# EAGLE design Cap Drop LDR (EAGLE 8.5.1)
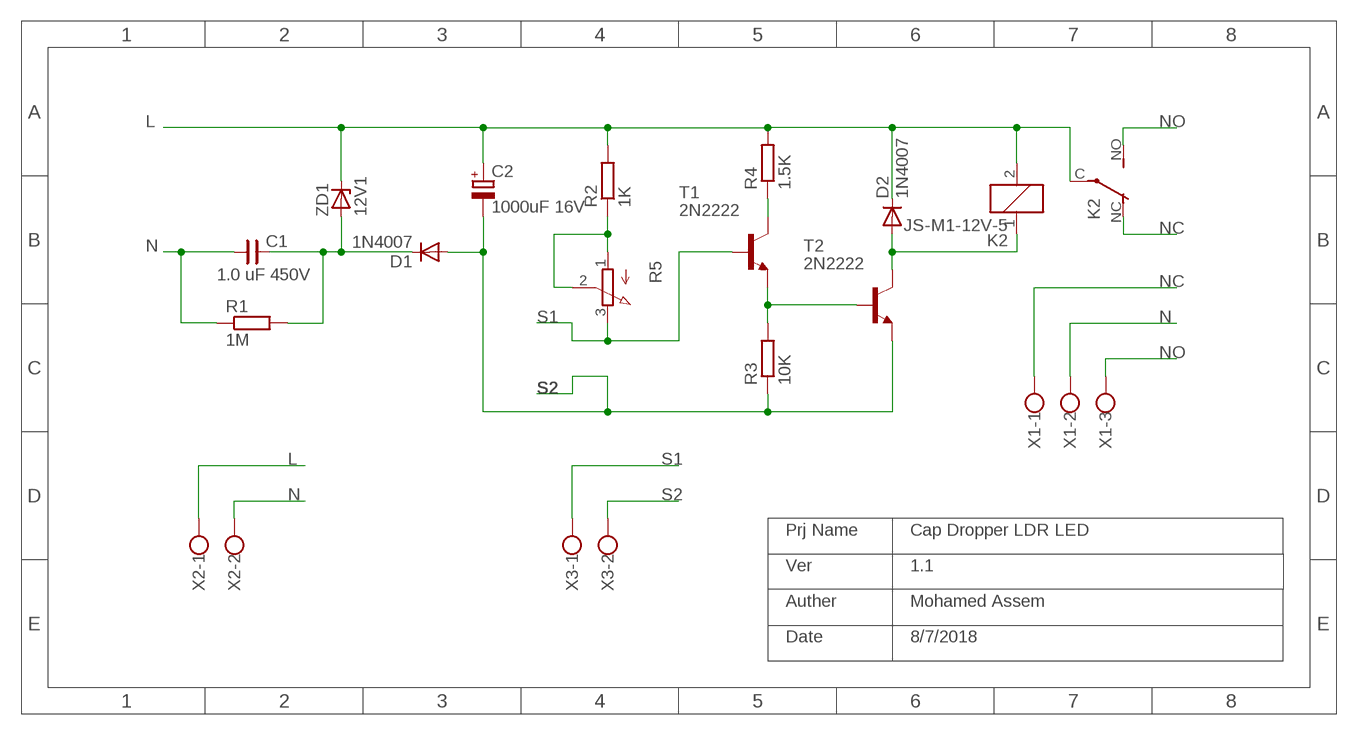
[diagram p0: schematic, sheet 1]

## Parts
C1  1.0 uF 450V  CNP-C150-190X070  [C150-190X070]
C2  1000uF 16V  CPOL-EUE5-8.5  [E5-8,5]
D1  1N4007  1N4004  [DO41-10]
D2  1N4007  1N4004  [DO41-10]
K2  JS-M1-12V-5  [JS-M]
R1  1M  R-EU_0207/10  [0207/10]
R2  1K  R-EU_0207/10  [0207/10]
R3  10K  R-EU_0207/10  [0207/10]
R4  1.5K  R-EU_0207/10  [0207/10]
R5  3RP/1610N  [3RP/1610N]
T1  2N2222  [TO92-EBC-OVAL]
T2  2N2222  [TO92-EBC-OVAL]
X1  W237-103  [W237-103]
X2  W237-102  [W237-102]
X3  W237-102  [W237-102]
ZD1  12V1  ZD-DO35Z10  [DO35Z10]

## Nets
L: C2.+ D2.C K2.2 K2.C(2:P) R2.2 R4.2 X2.1 ZD1.C
N: C1.1 R1.1 X1.2 X2.2
N$2: R3.2 T1.E T2.B
N$3: D2.A K2.1 T2.C
N$4: C1.2 D1.C R1.2 ZD1.A
N$6: R4.1 T1.C
N$8: R2.1 R5.1(A) R5.2(S)
NC: K2.NC(2:O) X1.1
NO: K2.NO(2:S) X1.3
S1: R5.3(E) T1.B X3.1
S2: C2.- D1.A R3.1 T2.E X3.2

## Notes on the sheet
- Prj Name | Cap Dropper LDR LED
- Ver | 1.1
- Auther | Mohamed Assem
- Date | 8/7/2018

## Library data of the parts
C1 = cap-master:CNP-: NON-POLARIZED CAP
C2 = rcl:CPOL-EU: POLARIZED CAPACITOR, European symbol; SPICEPREFIX: C
D1 D2 = adafruit:1N4004: DIODE General purpose 1N400x type rectifier (With bigger pads) http://www.ladyada.net/library/pcb/eaglelibrary.html
K2 = relay:JS-M1*: Automotive Ultra-Miniature Power Relay NAiS Source: http://www.mew-europe.com/.. en_ds_61211_0000.pdf; MF: FARNELL; MPN: JSM1-12V-5; OC_FARNELL: 910351; OC_NEWARK: 14J1764
R1-R4 = rcl:R-EU_: RESISTOR, European symbol; SPICEPREFIX: R
R5 = pot:3RP/1610N: 16mm Potentiometer one level Source: http://www.alphapotentiometers.net/html/16mm_pot_2.html
T1 T2 = adafruit:2N2222: NPN TRANSISTOR Big oval pads
X1 = con-wago-500:W237-103: WAGO SCREW CLAMP
X2 X3 = con-wago-500:W237-102: WAGO SCREW CLAMP
ZD1 = diodes:ZD-: Zener diode

## Board
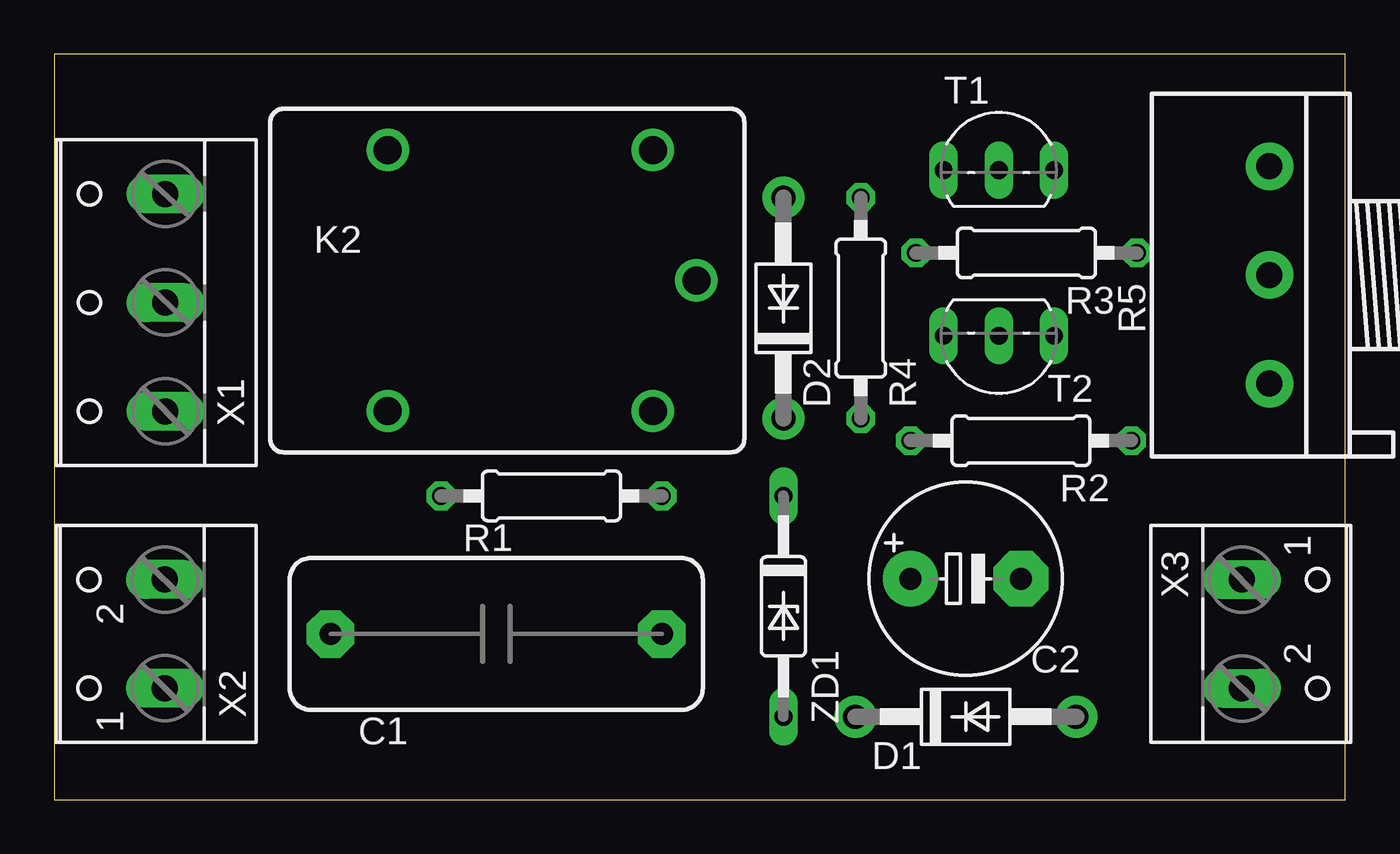
[diagram p1: board, top side]
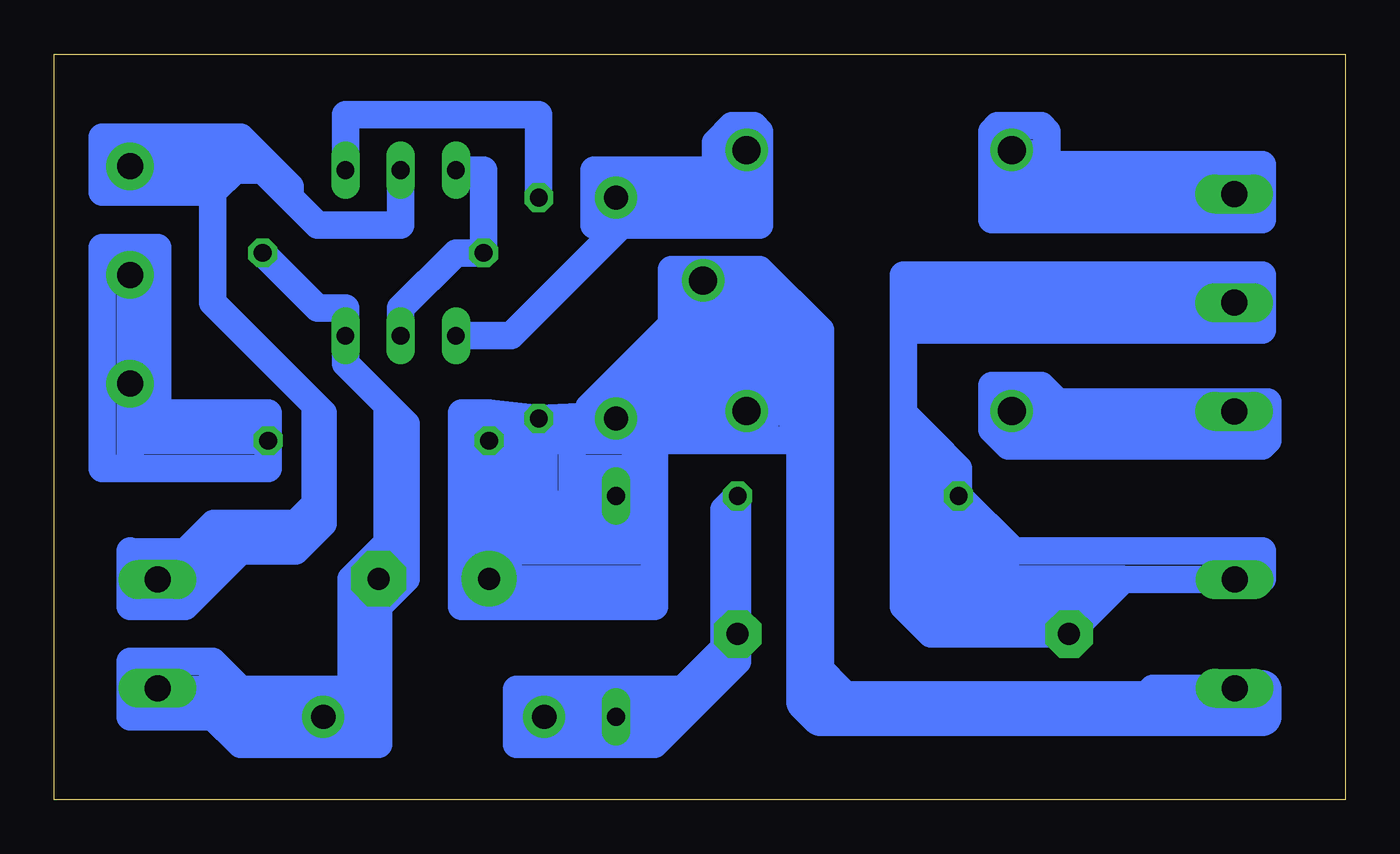
[diagram p2: board, bottom side, seen from below]

Size 59.36 x 34.28 mm. Coordinates in mm from the lower left corner, seen from the top.
Outline: 0,0 59.36,0 59.36,34.28 0,34.28 0,0
Copper layers (1*16): Top 0.035mm / dielectric 1.5mm / Bottom 0.035mm
Design rules "default *": minimum track width 30mil, minimum drill 0.35mm, track to track 20mil, track to pad 20mil, pad to pad 6mil, via to via 6mil, smd to smd 6mil, copper to edge 40mil, drill to drill 6mil, minimum pad ring 10mil, minimum via ring 8mil, stop-mask expansion 4mil, vias tented up to drill 0mil, thermal gap 10mil

### Footprints (pad centres in the part's own frame; a part is rotated, then mirrored left to right if it is on the bottom)
C150-190X070 = drill 1.016 pad 2.184 octagon: 1 -7.62,0; 2 7.62,0
E5-8,5 = drill 1.016 pad 2.54: + -2.54,0 | drill 1.016 pad 2.54 octagon: - 2.54,0
DO41-10 = drill 1.118 pad 1.93: A 5.08,0; C -5.08,0
JS-M = drill 1.3: 1 6.7,6; 2 6.7,-6; C 8.7,0; NC -5.5,-6; NO -5.5,6
0207/10 = drill 0.813 octagon: 1 -5.08,0; 2 5.08,0
3RP/1610N = drill 1.2 pad 2.184: 1 -5,0; 2 0,0; 3 5,0
TO92-EBC-OVAL = drill 0.813 long: B 0,-1.27; C 2.54,-1.27; E -2.54,-1.27
W237-103 = drill 1.194 long: 1 -5,-1.29; 2 0,-1.29; 3 5,-1.29
W237-102 = drill 1.194 long: 1 -2.5,-1.27; 2 2.5,-1.27
DO35Z10 = drill 0.813 long: A 5.08,0; C -5.08,0

### Placement (x,y rotation side)
C1  20.32,7.62 0 top
C2  41.91,10.16 0 top
D1  41.91,3.81 0 top
D2  33.53,22.61 90 top
K2  20.83,23.88 0 top
R1  22.86,13.97 0 top
R2  44.45,16.51 180 top
R3  44.7,25.15 180 top
R4  37.08,22.61 270 top
R5  55.88,24.13 90 top
T1  43.43,30.23 0 top
T2  43.43,20.07 180 top
X1  3.81,22.86 90 top
X2  3.81,7.62 90 top
X3  55.88,7.62 270 top
ZD1  33.53,8.89 270 top

### Tracks (layer width: path | path; a pad name or v marks a point on that pad's centre or on a via)
L
  Bottom 0.762: 24.13,5.08 22.86,5.08 | 22.86,5.08 7.62,5.08 6.35,3.81 | 24.13,6.35 22.86,5.08
  Bottom 1.27: 24.82,17.86 25.77,18.18 | 25.77,18.18 27.61,18.8 | 27.61,20.11 28.52,21.01 | 28.52,21.01 29.15,21.65 | D2.C 30.4,17.86 | 30.4,17.86 29.21,17.86 | 29.21,17.86 26.67,17.86 | 26.67,17.86 24.82,17.86 | D2.C 31.75,17.78 | 31.75,17.78 34.78,17.64 | 34.78,17.64 R4.2 | R4.2 35.56,16.51 | 35.56,16.51 36.83,16.51 | 36.83,16.51 38.1,16.51 | 38.1,16.51 R2.2 | ZD1.C 32.95,14.79 | 32.95,14.79 31.75,16.51 | 31.75,16.51 31.75,17.78 | 38.1,11.43 C2.+ 31.75,10.16 | 38.1,11.43 36.83,12.7 | 36.83,12.7 35.56,13.97 | 35.56,13.97 35.56,15.24 | 35.56,15.24 35.56,16.51 | 35.56,16.51 31.75,16.51 | ZD1.C 34.29,13.97 | 34.29,13.97 35.56,13.97 | 34.29,13.97 33.02,15.24 | 33.02,15.24 35.56,15.24 | 31.75,16.51 33.02,15.24 | ZD1.C 33.02,15.24 | 31.75,10.16 31.75,11.43 | 31.75,11.43 31.75,12.7 | 31.75,12.7 ZD1.C | 38.1,11.43 31.75,11.43 | 36.83,12.7 31.75,12.7 | 30.11,20.69 30.73,20.07 | 30.73,20.07 32.64,18.16 | 32.64,18.16 30.4,17.86 | D2.C 29.21,17.78 30.73,18.8 | 30.73,18.8 29.46,20.07 | 29.15,20.38 28.52,21.01 | 27.65,20.07 28.92,18.8 | 28.92,18.8 30.73,18.8 | 29.15,21.65 29.15,20.38 | 29.15,20.38 29.46,20.07 | 27.61,20.11 27.65,20.07 | 27.65,20.07 29.46,20.07 | 30.73,23.88 30.11,23.26 30.11,23.29 K2.C | 27.61,20.11 27.61,22.35 | 27.61,22.35 27.61,23.88 30.73,23.88 | 30.73,23.88 30.73,22.1 | 30.73,22.1 30.73,21.34 | 30.73,21.34 30.73,20.07 | 27.61,20.11 27.61,18.8 | 27.61,18.8 26.92,18.8 | 26.92,18.8 24.13,16.51 | 24.13,16.51 24.82,16.51 | 25.4,16.51 26.67,16.51 | 26.67,16.51 26.67,17.27 | 26.67,17.27 26.67,17.86 | 24.82,17.86 24.82,16.51 | 24.82,16.51 25.4,16.51 | 25.4,16.51 25.4,17.78 | 28.92,18.8 28.19,18.8 | 31.75,10.16 31.75,8.89 40.64,8.89 40.64,17.78 39.37,17.78 | R4.2 39.37,17.78 | 39.37,17.78 39.37,12.7
  Bottom 1.27: 39.37,11.43 39.37,12.7 | 36.83,12.7 36.83,16.51 | 38.1,12.7 36.83,12.7 | 38.1,12.7 39.37,12.7 | 38.1,16.51 38.1,12.7 | 31.75,16.51 30.99,16.51 | 30.99,16.51 30.56,16.51 | 29.8,17.27 29.21,17.86 | 32.64,18.16 32.64,19.43 | 32.64,19.43 30.73,21.34 | 32.64,19.43 31.75,17.78 | X2.1 8.85,5.12 10.16,3.81 | 24.13,16.51 24.13,6.35 24.13,5.08 | 28.92,18.8 28.92,18.57 30.99,16.51 | 30.56,16.51 26.67,16.51 | K2.2 29.15,18.49 29.15,20.38 | 29.15,20.38 30.99,22.21 30.99,24.38 26.92,24.38 24.13,21.59 24.13,16.51 | 24.13,16.51 24.89,17.27 24.89,21.34 25.77,22.22 | 26.92,23.37 26.54,22.99 | 26.54,22.99 25.77,22.22 | 25.77,22.22 25.77,18.18 | 25.77,18.18 26.39,18.8 26.92,18.8 | 26.54,22.99 26.67,22.86 26.67,19.3 | 30.73,21.34 29.21,22.86 28.7,22.86 | 29.15,21.65 28.25,21.65 28.19,21.59 | 30.73,22.1 34.78,18.05 34.78,17.64 | 34.78,17.64 34.25,18.16 32.64,18.16 | 29.15,21.65 28.45,22.35 27.61,22.35 | 30.56,16.51 29.8,17.27 | 29.8,17.27 26.67,17.27 | 39.37,12.7 38.61,11.94 38.61,11.68 | 24.13,3.81 11.18,3.81 | 31.75,12.7 31.75,16.51 | 32.95,14.79 32.51,14.35 32.51,13.97 | 35.56,13.97 35.05,13.46 34.29,13.46
  Bottom 1.778: 24.82,17.86 24.82,4.5 24.13,3.81 22.86,3.81 | X2.1 5.04,5.08 3.81,5.08 3.81,3.81 6.35,3.81 10.16,3.81 11.18,3.81 22.86,3.81 | 24.13,5.08 22.86,3.81
N
  Bottom 1.27: X2.2 10.2,10.12 | 10.2,10.12 11.43,8.89 | 11.43,8.89 C1.1 | C1.1 13.97,8.89 | 13.97,8.89 14.61,9.53 | 14.61,9.53 15.24,10.16 | 15.24,10.16 17.78,12.7 | 17.78,12.7 R1.1 | R1.1 17.78,15.24 19.05,16.51 | 20.32,17.78 19.05,16.51 | 5.08,22.86 X1.2 | X1.2 5.08,22.88 5.08,24.13 | 5.08,24.13 20.32,24.13 20.32,22.86 | 20.32,22.86 20.32,21.59 | 20.32,21.59 20.32,17.78 | 20.32,22.86 X1.2 | X1.2 5.1,21.61 5.08,21.59 | 20.32,21.59 5.08,21.59 | 5.08,24.13 3.81,24.13 3.81,21.59 5.08,21.59 | X2.2 5.08,11.43 | 5.08,11.43 3.81,11.43 3.81,10.16 5.04,10.16 X2.2 | R1.1 15.24,11.43 5.08,11.43 | 17.78,12.7 19.05,12.7 | 20.32,12.7 20.32,17.78 | 19.05,12.7 19.05,16.51 | 15.24,10.16 10.24,10.16 10.2,10.12 | 14.61,9.53 12.06,9.53 11.43,8.89 | 13.97,8.89 12.7,8.89 | 20.32,11.43 20.32,8.89 19.05,7.62 C1.1 | 20.32,11.43 20.32,12.7 | 20.32,11.43 19.05,10.16 | 19.05,10.16 17.78,8.89 | 17.78,8.89 19.05,8.89 19.05,10.16 | 19.05,12.7 16.51,10.16 16.51,8.89 | 16.51,8.89 20.32,12.7 | 17.78,8.89 16.51,8.89 | 16.51,8.89 13.97,8.89 | 15.24,10.16 16.51,8.89
N$2
  Bottom 1.27: T1.E 39.62,28.96 R3.2 40.89,25.15 43.43,22.61 T2.B
N$3
  Bottom 1.27: 27.61,27.61 33.19,27.61 D2.A | D2.A 33.27,26.42 | 33.27,26.42 38.35,21.34 T2.C | 27.69,26.92 28.19,26.42 | 28.19,26.42 33.27,26.42 | 28.19,26.42 26.92,26.42 26.92,30.73 27.18,30.99 28.19,30.99 28.96,30.23 28.96,28.96 | 33.27,28.96 28.96,28.96 | D2.A 32,27.69 | 32,27.69 33.27,28.96 | 33.27,28.96 34.54,28.96 34.54,27.69 | 34.54,26.42 34.54,27.69 | 34.54,27.69 33.27,28.96 | 27.61,27.61 27.69,27.69 32,27.69 | K2.1 28.19,29.21 28.19,28.7 | 28.19,28.7 28.45,28.7 28.96,28.19 | 28.96,28.96 28.19,28.19 | 28.19,28.19 27.43,28.19 | 28.19,28.7 28.19,28.19 | 27.61,27.61 28.3,26.92 | 28.3,26.92 28.7,26.92 | 28.3,26.92 27.69,26.92 | 27.69,26.92 27.61,27
N$4
  Bottom 1.27: C1.2 R1.2 28.57,13.34 28.57,6.99 | 31.7,4.47 ZD1.A D1.C 35.56,2.54 | 31.7,4.47 30.48,5.08 | 30.48,5.08 28.57,6.99 | 28.57,6.99 C1.2 | 28.57,6.99 27.94,6.35 | 27.94,6.35 31.75,2.54 35.56,2.54 | 27.94,6.35 C1.2 | 35.56,2.54 38.1,2.54 38.1,5.08 30.48,5.08 | 33.27,3.3 32,3.3 31.7,3.61 31.7,4.47
N$6
  Bottom 1.27: R4.1 37.08,31.5 45.97,31.5 T1.C
N$8
  Bottom 1.27: 55.88,16.51 R5.2 55.88,25.4 | 55.88,16.51 R2.1 | 55.88,25.4 54.61,25.4 54.61,17.86 | 54.61,17.78 55.88,16.51 | 54.61,17.78 49.53,17.78 R2.1 | R2.1 49.53,15.24 55.88,15.24 | 55.88,15.24 55.88,16.51 | R5.1 54.61,17.86 | 54.61,17.86 54.61,17.78 | 55.88,25.4 57.15,25.4 57.15,15.24 55.88,15.24
NC
  Bottom 1.27: K2.NC 3.65,16.86 3.56,16.76 3.56,18.29 13.46,18.29 13.46,18.54 13.97,19.05 16.26,19.05 16.26,17.02 15.49,16.26 3.81,16.26 3.56,16.51 | K2.NC 14.33,17.86 X1.1 | K2.NC 14.47,17.02 11.68,17.02
NO
  Bottom 1.27: X1.3 5.08,27.88 | 14.62,28.56 13.97,29.21 | 13.97,29.21 5.08,29.21 | 3.81,27.94 5.08,29.21 | 5.08,29.21 5.1,29.19 X1.3 | X1.3 5.18,27.94 14.54,27.94 | 3.81,29.15 3.81,29.21 | X1.3 3.81,29.15 | 3.81,29.15 3.81,27.94 | X1.3 5.02,27.94 3.81,27.94 | 3.81,29.15 3.87,29.21 5.08,29.21 | 13.97,29.21 15.24,29.21 | 15.24,29.21 15.24,27.94 | 15.24,27.24 15.24,26.67 | 15.24,26.67 3.81,26.67 3.81,27.94 | 14.47,29.72 K2.NO 15.33,29.3 15.24,29.21 | 14.47,29.72 13.72,29.72 13.72,30.73 13.97,30.99 16,30.99 16.26,30.73 16.26,29.72 | 14.47,29.72 16.26,29.72 | 16.26,29.72 16.26,26.67 15.24,26.67
S1
  Bottom 1.27: T1.B 43.43,26.42 47.24,26.42 48.51,27.69 | 49.78,28.96 49.53,29.21 55.8,29.21 R5.3 | 50.8,12.7 52.03,12.7 53.34,11.39 | 50.8,12.7 48.26,12.7 | 48.26,12.7 46.99,12.7 | 52.07,27.94 57.15,27.94 57.15,30.48 50.8,30.48 48.51,28.19 48.51,27.69 | X3.1 54.65,10.12 55.88,8.89 | 55.88,8.89 53.34,8.89 | 53.34,8.89 53.34,10.16 | 53.34,10.16 53.34,11.39 | 53.34,11.39 55.84,11.39 55.88,11.43 55.88,8.89 | 50.8,12.7 53.34,10.16 | 46.99,12.7 48.26,11.43 50.8,11.43 53.34,8.89 | 49.78,28.96 48.51,27.69 | 52.07,27.94 52.07,22.86 47.37,18.16 | 46.99,13.97 47.37,13.59 | 47.37,13.59 48.26,12.7 | 47.37,13.59 47.37,18.16 | 46.99,12.7 46.99,17.78 47.37,18.16 | 52.07,27.94 51.05,28.96 49.78,28.96
S2
  Bottom 1.27: 43.18,12.7 43.18,10.16 | 43.18,10.16 C2.- 44.45,8.89 | R3.1 47.24,22.61 45.97,22.61 T2.E 45.97,20.07 44.07,18.16 | 44.45,5.08 44.45,3.81 | 44.45,3.81 D1.A | 44.45,5.08 45.72,5.08 | 45.72,5.08 48.26,5.08 | 48.26,5.08 48.26,3.81 | 48.26,3.81 48.26,2.54 | 48.26,2.54 44.45,2.54 44.45,3.81 | X3.2 54.65,5.12 55.88,6.35 | 52.07,6.35 52.07,3.81 | 52.07,3.81 55.88,3.81 55.88,6.35 | 55.88,6.35 54.61,6.35 | 54.61,6.35 53.34,5.08 50.8,5.08 | 54.61,6.35 52.07,6.35 | 52.07,3.81 48.26,3.81 | 52.07,3.81 50.8,2.54 48.26,2.54 | 52.07,6.35 50.8,5.08 | 50.8,5.08 48.26,5.08 | 45.72,5.08 45.72,10.16 44.07,11.81 | 44.07,11.81 43.18,12.7 | 44.45,8.89 44.45,5.08 | 43.18,10.16 44.45,8.89 | 43.18,12.7 43.18,17.27 44.07,18.16 | 44.07,11.81 44.07,18.16